# EasyEDA Pro project Module32Switches_SM.epro

# Schematic Main
Board Name: 32 switches module; Create Date: 2025-06-25; Page Name: P1; Project Name: Module32Switches_SM; Schematic Name: Main; Update Date: 2025-06-27; Company: EasyEDA.com; Page Size: A4; Version: V1.0
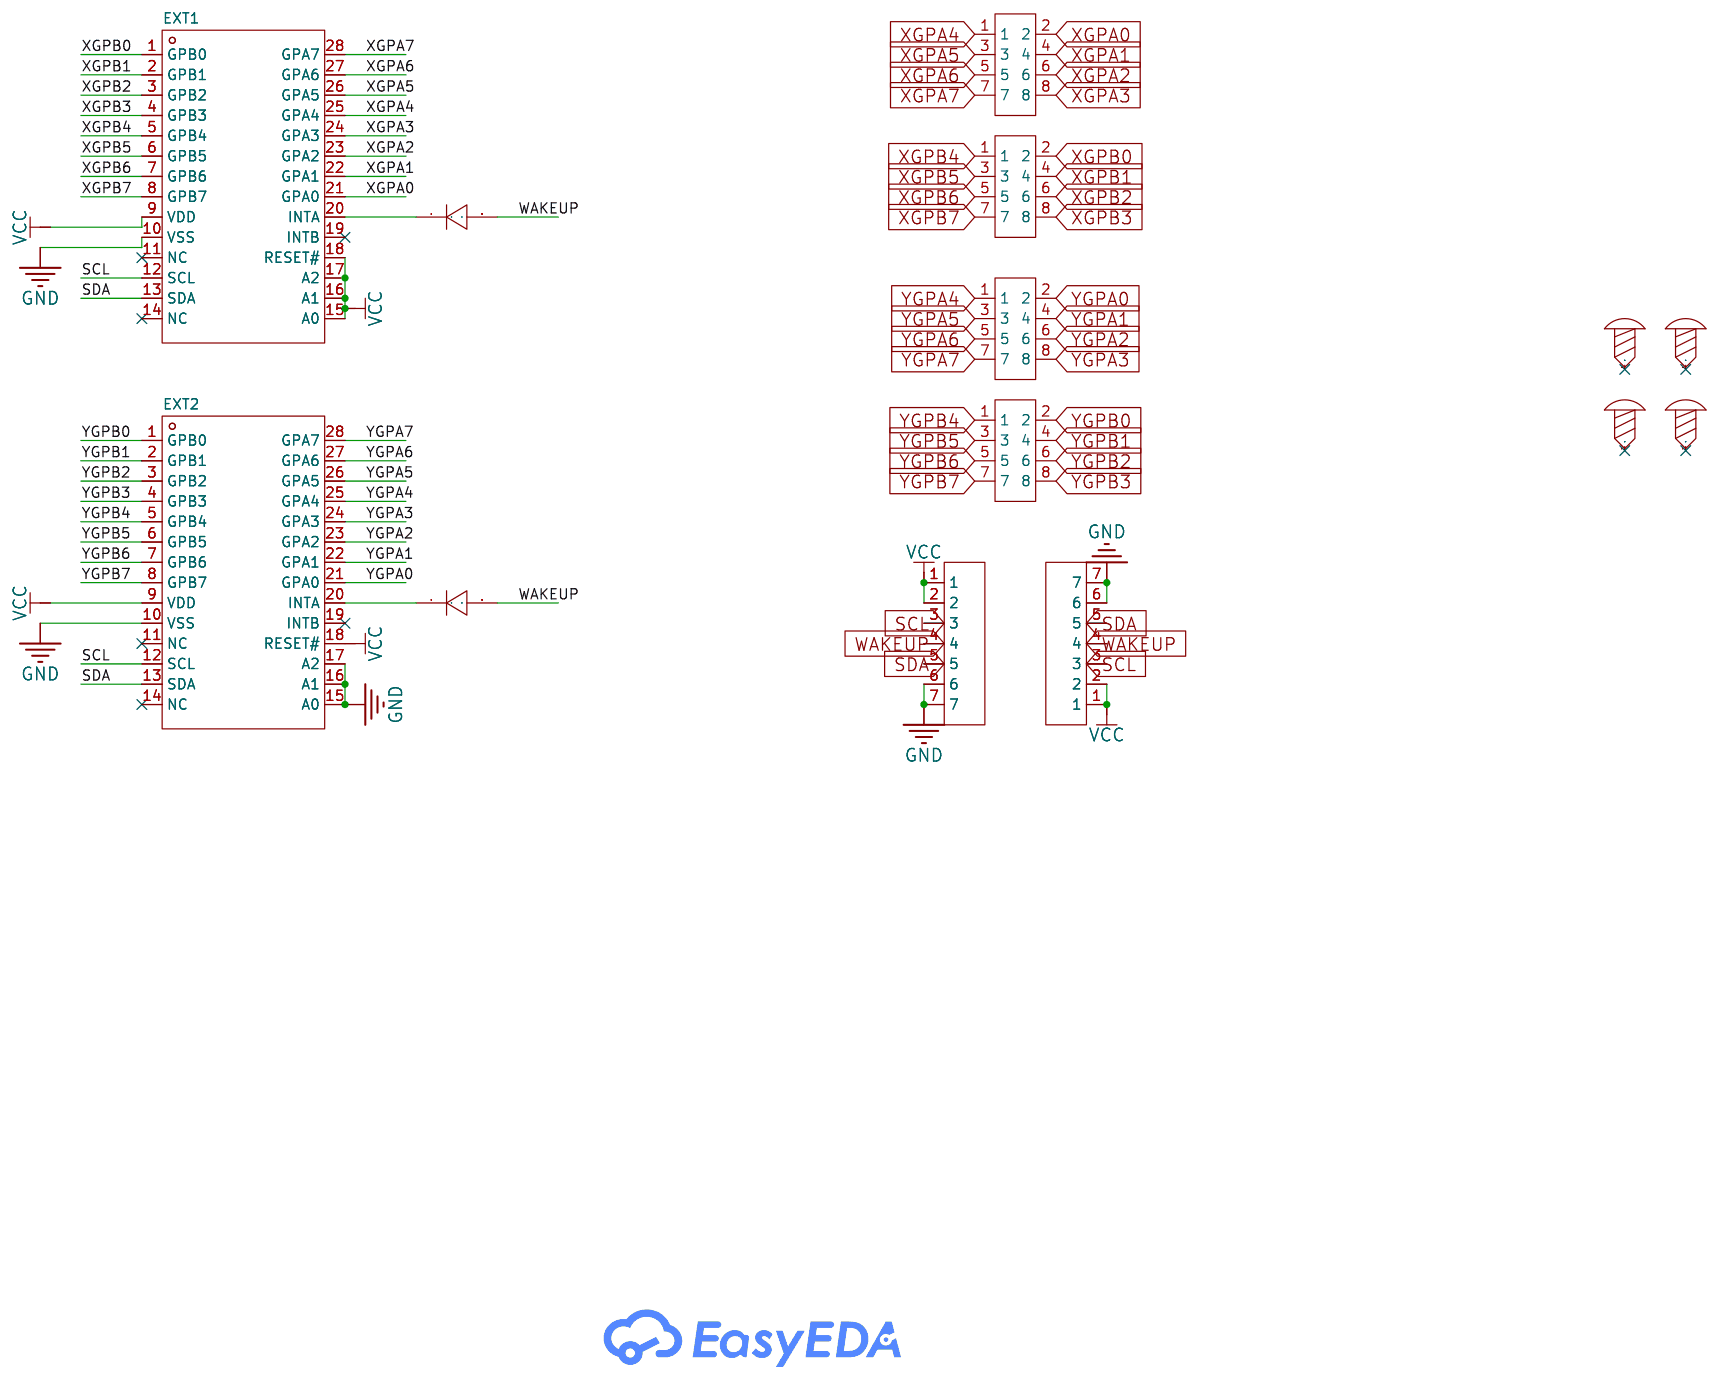
[diagram p0: schematic sheet]

## Parts
D1  1N4148W  [SOD-123F_L2.7-W1.6-LS3.8-RD]
D2  1N4148W  [SOD-123F_L2.7-W1.6-LS3.8-RD]
DEVKIT1  -  [HDR-TH_7P-P2.54-V-M]  (no BOM)
DEVKIT2  -  [HDR-TH_7P-P2.54-V-M]  (no BOM)
EXT1  MCP23017T-E/ML  [QFN-28_L6.0-W6.0-P0.65-BL-EP3.7]
EXT2  MCP23017T-E/ML  [QFN-28_L6.0-W6.0-P0.65-BL-EP3.7]
SCREW1  -  [Screw-Hole-M2]  (no BOM)
SCREW2  -  [Screw-Hole-M2]  (no BOM)
SCREW3  -  [Screw-Hole-M2]  (no BOM)
SCREW4  -  [Screw-Hole-M2]  (no BOM)
XH1  PZ254R-12-8P  [HDR-TH_8P-P2.54-H-M-R2-C4-S2.54]  (no BOM)
XH2  PZ254R-12-8P  [HDR-TH_8P-P2.54-H-M-R2-C4-S2.54]  (no BOM)
YH1  PZ254R-12-8P  [HDR-TH_8P-P2.54-H-M-R2-C4-S2.54]  (no BOM)
YH2  PZ254R-12-8P  [HDR-TH_8P-P2.54-H-M-R2-C4-S2.54]  (no BOM)

## Library data of the parts
D1 D2 = 1N4148W_C81598: Diode Configuration:Independent Type Forward Voltage (Vf@If):1V@50mA Reverse Voltage (Vr): Rectified Current: Reverse Leakage Current (Ir):1uA@75V Reverse Recovery Time (trr): Operating Temperature:- Operating Temperature:-; Supplier Part: C81598; Manufacturer: ST(先科); Supplier Footprint: SOD-123; JLCPCB Part Class: Basic Part; Datasheet: https://atta.szlcsc.com/upload/public/pdf/source/20161024/1477288446905.pdf; Supplier: LCSC; Diode Configuration: Independent Type; Forward Voltage (Vf@If): 1V@50mA; Reverse Leakage Current (Ir): 1uA@75V
DEVKIT1 DEVKIT2 = HDR-M_2.54_1x7P: Supplier Footprint: Through
EXT1 EXT2 = MCP23017T-E/ML: Interface:- Number of I/O:16 Interrupt Output:With Interrupt Output Output Type:- Voltage - Supply:1.8V~5.5V Voltage - Supply:1.8V~5.5V Current - Output Low(IOL):- Current - Output High(IOH):- Clock Frequency:- Operating Temperature:-40℃~+125℃ Operating T; LCSC Part Name: 16位带串行接口的I/O扩展器; Supplier Part: C629439; Manufacturer: MICROCHIP(美国微芯); Supplier Footprint: QFN-28-EP(6x6); JLCPCB Part Class: Extended Part; Datasheet: https://atta.szlcsc.com/upload/public/pdf/source/20221209/1BF939F88C2D907BC056D7BF485E3103.pdf; Supplier: LCSC; Number of I/O: 16; Interrupt Output: With Interrupt Output; Voltage - Supply: 1.8V~5.5V; Operating Temperature: -40℃~+125℃
SCREW1-SCREW4 = Screw-Hole-M2: Supplier Footprint: 插件
XH1 XH2 YH1 YH2 = PZ254R-12-8P: Pin Structure:2x4P Pitch:2.54mm Row Spacing:2.54mm Circluar Pins/Square Pins:Policy Mounting Type:Right-Angle Number of Rows:Double Row Number of Pins:8P Current Rating:- Voltage Rating (Max):- Length of Mating Pin:6mm Insulation Height:2.5mm Contact Mate; LCSC Part Name: 2x4P 间距:2.54mm 方针 弯插; Supplier Part: C492432; Manufacturer: XFCN(兴飞); Supplier Footprint: 弯插,P=2.54mm; JLCPCB Part Class: Extended Part; Datasheet: https://atta.szlcsc.com/upload/public/pdf/source/20200309/C492432_F55471C7391A7FE3415CB31C718B6320.pdf; Supplier: LCSC; Pin Structure: 2x4P; Pitch: 2.54mm; Row Spacing: 2.54mm; Circluar Pins/Square Pins: Policy; Mounting Type: Right-Angle; Number of Rows: Double Row; Number of Pins: 8P; Length of Mating Pin: 6mm; Insulation Height: 2.5mm; Contact Material: Brass; Operating Temperature: -40℃~+105℃; Color: Black

## Nets
GND: DEVKIT1.6 DEVKIT1.7 DEVKIT2.6 DEVKIT2.7 EXT1.10(VSS) EXT2.10(VSS) EXT2.15(A0) EXT2.16(A1) EXT2.17(A2)
VCC: DEVKIT1.1 DEVKIT1.2 DEVKIT2.1 DEVKIT2.2 EXT1.9(VDD) EXT1.15(A0) EXT1.16(A1) EXT1.17(A2) EXT1.18(RESET#) EXT2.9(VDD) EXT2.18(RESET#)
SCL: DEVKIT1.3 DEVKIT2.3 EXT1.12(SCL) EXT2.12(SCL)
SDA: DEVKIT1.5 DEVKIT2.5 EXT1.13(SDA) EXT2.13(SDA)
WAKEUP: D1.2(A) D2.2(A) DEVKIT1.4 DEVKIT2.4
XGPA0: EXT1.21(GPA0) XH1.2
XGPA1: EXT1.22(GPA1) XH1.4
XGPA2: EXT1.23(GPA2) XH1.6
XGPA3: EXT1.24(GPA3) XH1.8
XGPA4: EXT1.25(GPA4) XH1.1
XGPA5: EXT1.26(GPA5) XH1.3
XGPA6: EXT1.27(GPA6) XH1.5
XGPA7: EXT1.28(GPA7) XH1.7
XGPB0: EXT1.1(GPB0) XH2.2
XGPB1: EXT1.2(GPB1) XH2.4
XGPB2: EXT1.3(GPB2) XH2.6
XGPB3: EXT1.4(GPB3) XH2.8
XGPB4: EXT1.5(GPB4) XH2.1
XGPB5: EXT1.6(GPB5) XH2.3
XGPB6: EXT1.7(GPB6) XH2.5
XGPB7: EXT1.8(GPB7) XH2.7
YGPA0: EXT2.21(GPA0) YH1.2
YGPA1: EXT2.22(GPA1) YH1.4
YGPA2: EXT2.23(GPA2) YH1.6
YGPA3: EXT2.24(GPA3) YH1.8
YGPA4: EXT2.25(GPA4) YH1.1
YGPA5: EXT2.26(GPA5) YH1.3
YGPA6: EXT2.27(GPA6) YH1.5
YGPA7: EXT2.28(GPA7) YH1.7
YGPB0: EXT2.1(GPB0) YH2.2
YGPB1: EXT2.2(GPB1) YH2.4
YGPB2: EXT2.3(GPB2) YH2.6
YGPB3: EXT2.4(GPB3) YH2.8
YGPB4: EXT2.5(GPB4) YH2.1
YGPB5: EXT2.6(GPB5) YH2.3
YGPB6: EXT2.7(GPB6) YH2.5
YGPB7: EXT2.8(GPB7) YH2.7
$1N593: D1.1(K) EXT1.20(INTA)
$1N5957: D2.1(K) EXT2.20(INTA)

Not connected (* = marked no-connect by the designer): EXT1 11(NC)* 14(NC)* 19(INTB)*; EXT2 11(NC)* 14(NC)* 19(INTB)*; SCREW1 1*; SCREW2 1*; SCREW3 1*; SCREW4 1*

# Board PCB
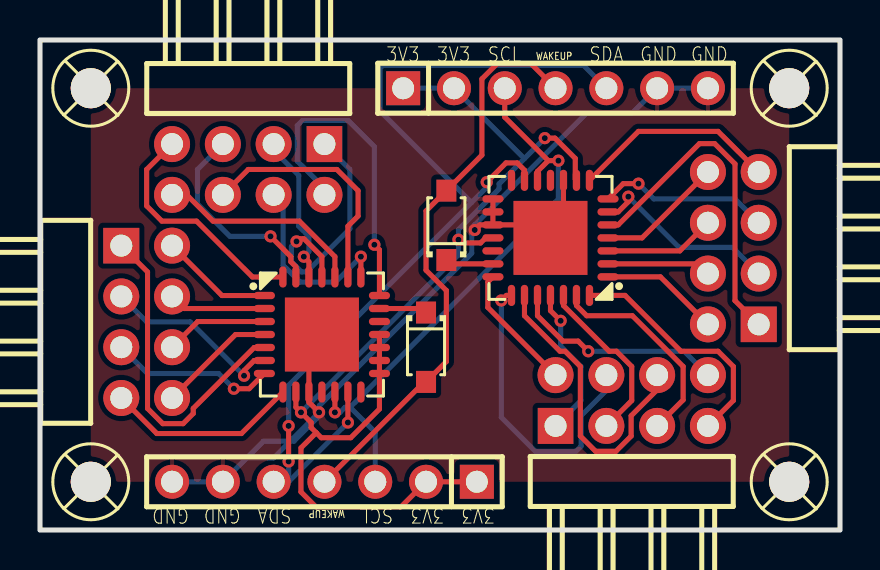
[diagram p1: board, top side]
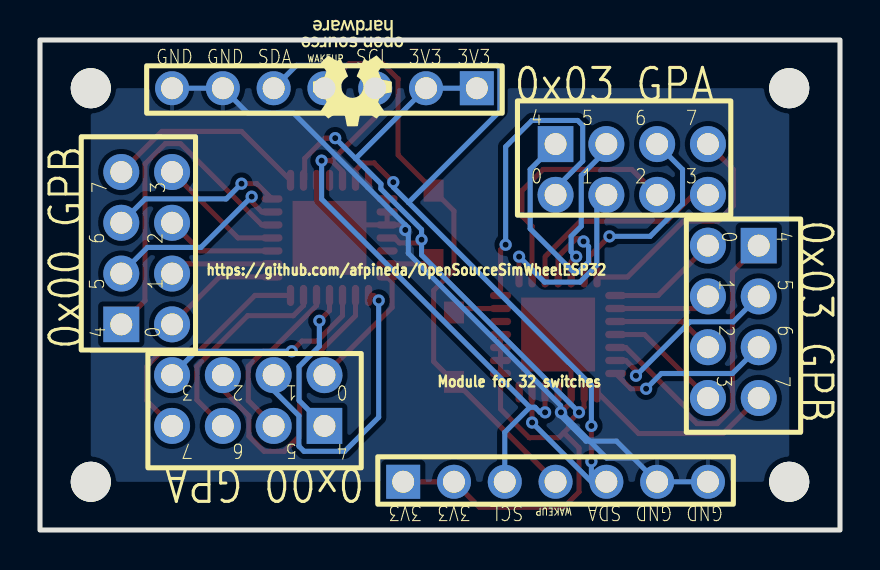
[diagram p2: board, bottom side, seen from below]

Outline 40 x 24.51 mm; copper layers: Top Layer, Bottom Layer. Coordinates in mm from the lower left corner of the outline.
Outline path: rectangle 0,24.51 40,0
Stack: Top Layer 0.035mm / Dielectric1 1.51mm FR4 er 4.5 / Bottom Layer 0.035mm

## Design rules (mm)
template: JLCPCB Capability(Two Layers Board)
spacing copperThickness1oz (default): track to track 0.102, other pairs 0.152 to 0.3
spacing copperThickness2oz: track to track 0.203, other pairs 0.152 to 0.3
track width copperThickness1oz (default): min 0.127, default 0.254, max 2.54
track width copperThickness2oz: min 0.203, default 0.254, max 2.54
differential pair differentialPair (default): width min 0.127, default 0.254, max 2.54; gap min 0.152, default 0.152
via viaSize (default): diameter min 0.5, default 0.61, max 10; hole min 0.3, default 0.305, max 6.3

## Placement (name value [footprint] x y rotation side)
D1  1N4148W  [SOD-123F_L2.7-W1.6-LS3.8-RD]  19.3 9.14 270 top
D2  1N4148W  [SOD-123F_L2.7-W1.6-LS3.8-RD]  20.32 15.24 90 top
DEVKIT1  -  [HDR-TH_7P-P2.54-V-M]  14.22 2.41 180 top
DEVKIT2  -  [HDR-TH_7P-P2.54-V-M]  25.78 22.1 0 top
EXT1  MCP23017T-E/ML  [QFN-28_L6.0-W6.0-P0.65-BL-EP3.7]  14.1 9.78 270 top
EXT2  MCP23017T-E/ML  [QFN-28_L6.0-W6.0-P0.65-BL-EP3.7]  25.53 14.61 90 top
SCREW1  -  [Screw-Hole-M2]  37.47 22.1 0 top
SCREW2  -  [Screw-Hole-M2]  37.47 2.41 0 top
SCREW3  -  [Screw-Hole-M2]  2.54 2.41 0 top
SCREW4  -  [Screw-Hole-M2]  2.54 22.1 0 top
XH1  PZ254R-12-8P  [HDR-TH_8P-P2.54-H-M-R2-C4-S2.54]  10.41 18.03 180 top
XH2  PZ254R-12-8P  [HDR-TH_8P-P2.54-H-M-R2-C4-S2.54]  5.33 10.41 270 top
YH1  PZ254R-12-8P  [HDR-TH_8P-P2.54-H-M-R2-C4-S2.54]  29.59 6.48 0 top
YH2  PZ254R-12-8P  [HDR-TH_8P-P2.54-H-M-R2-C4-S2.54]  34.67 14.1 90 top

## Footprints (pads in the part's own frame, mm; a bottom-side part is the same pattern mirrored in y, then rotated)
HDR-TH_7P-P2.54-V-M
  rect 1.7x1.7 hole 1.1: 1(-7.62,0)
  round 1.7 hole 1.1: 2(-5.08,0) 3(-2.54,0) 4(0,0) 5(2.54,0) 6(5.08,0) 7(7.62,0)
HDR-TH_8P-P2.54-H-M-R2-C4-S2.54
  rect 1.778x1.8 hole 1.1: 1(-3.81,-1.27)
  round 1.8 hole 1.1: 2(-3.81,1.27) 3(-1.27,-1.27) 4(-1.27,1.27) 5(1.27,-1.27) 6(1.27,1.27) 7(3.81,-1.27) 8(3.81,1.27)
QFN-28_L6.0-W6.0-P0.65-BL-EP3.7
  oval 0.364x1.055 smd: 1(-1.95,-2.877) 2(-1.3,-2.877) 3(-0.65,-2.877) 4(0,-2.877) 5(0.65,-2.877) 6(1.3,-2.877) 7(1.95,-2.877) 15(1.95,2.877) 16(1.3,2.877) 17(0.65,2.877) 18(0,2.877) 19(-0.65,2.877) 20(-1.3,2.877) 21(-1.95,2.877)
  oval 1.055x0.364 smd: 8(2.877,-1.95) 9(2.877,-1.3) 10(2.877,-0.65) 11(2.877,0) 12(2.877,0.65) 13(2.877,1.3) 14(2.877,1.95) 22(-2.877,1.95) 23(-2.877,1.3) 24(-2.877,0.65) 25(-2.877,0) 26(-2.877,-0.65) 27(-2.877,-1.3) 28(-2.877,-1.95)
  rect 3.7x3.7 smd: 29(0,0)
Screw-Hole-M2
  round 2 hole 2: 1(0,0)
SOD-123F_L2.7-W1.6-LS3.8-RD
  rect 1.1x1 smd: 1(-1.735,0) 2(1.735,0)

## Nets
As in the schematic, except:
GND: DEVKIT1.6 DEVKIT1.7 DEVKIT2.6 DEVKIT2.7 EXT1.10 EXT1.29 EXT2.10 EXT2.15 EXT2.16 EXT2.17 EXT2.29

Pads without a net: EXT1 11 14 19; EXT2 11 14 19; SCREW1 1; SCREW2 1; SCREW3 1; SCREW4 1

## Via types
v1: diameter 0.61, hole 0.305, Top Layer to Bottom Layer, 23 vias

## Routing (per net, layer and track width the routed paths; a pad name or vN(x,y) marks a point on that pad's centre or on a via; arc(x,y) is an arc through that point)
GND: length 53.7
  Top Layer w0.254: 25.38,14.75 EXT2.29 ; 25.38,14.75 26.18,15.55 EXT2.10 ; 25.38,14.75 24.94,14.75 24.43,15.26 EXT2.17 ; EXT2.15 EXT2.16 EXT2.17 ; v1(13.96,5.89) 13.45,6.39 EXT1.10 13.45,9.13 EXT1.29 ; v1(21.74,15.01) 21.99,15.26 EXT2.17
  Bottom Layer w0.254: 21.74,15.26 21.59,15.11 21.59,13.84 13.97,6.22 13.97,5.72 12.7,4.44 12.51,4.44 ; 21.74,15.26 27.33,20.85 29.61,20.85 30.86,22.1 DEVKIT2.7 ; 21.74,15.26 v1(21.74,15.01) ; v1(13.96,5.89) 12.51,4.44 ; 12.51,4.44 11.18,4.44 10.33,3.6 ; 12.51,4.44 11.67,3.6 10.33,3.6 ; DEVKIT1.7 DEVKIT1.6 10.33,3.6
VCC: length 54.2
  Top Layer w0.254: EXT1.9 12.8,6.14 v1(13.05,5.89) 13.56,5.38 13.56,5.12 13.81,4.87 ; EXT2.18 22.29,14.61 22.03,14.36 21.09,14.36 v1(20.93,14.52) ; 13.81,4.87 13.05,4.11 13.05,1.91 13.81,1.14 18.03,1.14 DEVKIT1.2 DEVKIT1.1 ; 13.81,4.87 14.07,4.62 15.54,4.62 16.97,6.05 EXT1.15 EXT1.16 EXT1.17 EXT1.18 ; EXT2.9 26.77,17.55 26.77,18.59 25.75,19.6 v1(25.24,19.6)
  Bottom Layer w0.254: DEVKIT2.1 DEVKIT2.2 24.21,18.59 24.23,18.59 ; 24.23,18.59 22.96,17.32 22.96,17.06 20.93,15.03 v1(20.93,14.52) 20.93,13.76 v1(13.05,5.89) ; 24.23,18.59 v1(25.24,19.6)
SCL: length 29
  Top Layer w0.254: 25.41,18.48 24.88,17.94 EXT2.12 ; 25.41,18.48 23.24,20.65 DEVKIT2.3 ; 25.41,18.48 v1(25.92,18.48) ; EXT1.12 v1(14.75,5.89)
  Bottom Layer w0.254: DEVKIT1.3 16.76,4.88 15.51,6.14 ; 15.51,6.14 25.92,16.55 v1(25.92,18.48) ; 15.51,6.14 15.25,6.14 15,5.89 v1(14.75,5.89)
SDA: length 49
  Top Layer w0.254: 24.23,17.49 24.23,18 23.86,18.36 23.3,18.36 v1(22.34,17.4) ; 15.4,6.9 v1(15.4,5.38) ; v1(12.43,3.43) v1(12.43,5.21)
  Bottom Layer w0.254: DEVKIT2.5 27.18,23.24 17.15,23.24 17,23.09 17,20.95 21.58,16.38 ; v1(15.4,5.38) 12.43,2.41 ; 12.43,2.41 DEVKIT1.5 ; 12.43,2.41 v1(12.43,3.43) ; v1(22.34,17.4) 22.34,17.14 21.58,16.38 ; 21.58,16.38 12.43,7.24 v1(12.43,5.21)
WAKEUP: length 28.8
  Top Layer w0.254: DEVKIT2.4 24.55,23.33 22.86,23.33 22.1,22.56 22.1,18.75 D2.2 19.3,15.96 19.3,13 20.32,11.98 20.32,8.42 D1.2 19.22,7.41 DEVKIT1.4
XGPA0: length 16.1
  Top Layer w0.254: EXT1.21 16.97,14.02 v1(16.72,14.27)
  Bottom Layer w0.254: v1(16.72,14.27) 16.72,19.17 15.41,20.49 13.12,20.49 12.87,20.23 12.87,18.45 14.14,17.18 14.14,16.85 XH1.2
XGPA1: length 9.5
  Top Layer w0.254: EXT1.22 v1(16.05,13.67)
  Bottom Layer w0.254: v1(16.05,13.67) 14.78,12.4 13,12.4 12.16,13.24 12.16,16.29 XH1.4
XGPA2: length 12.3
  Top Layer w0.254: 15.4,12.66 15.4,15.2 15.91,15.7 15.91,16.97 14.85,18.03 10.41,18.03 XH1.6
XGPA3: length 10.4
  Top Layer w0.254: XH1.8 6.65,16.72 7.38,16.72 8.65,15.45 12.97,15.45 14.75,13.67 EXT1.24
XGPA4: length 12.6
  Top Layer w0.254: v1(12.83,14.43) 12.96,14.57 13.2,14.57 14.1,13.67 EXT1.25
  Bottom Layer w0.254: v1(12.83,14.43) 12.57,14.18 12.57,13.42 13.08,12.91 13.34,12.91 15.49,15.07 15.49,18.03 XH1.1
XGPA5: length 7.6
  Top Layer w0.254: EXT1.26 13.45,13.42 v1(13.19,13.67)
  Bottom Layer w0.254: v1(13.19,13.67) 13.45,13.93 13.45,14.69 12.94,15.2 12.94,17.74 11.68,18.99 XH1.3
XGPA6: length 10.4
  Top Layer w0.254: v1(11.53,14.69) 12.54,13.67 12.54,13.42 12.8,13.16 EXT1.27
  Bottom Layer w0.254: XH1.5 7.87,18.03 7.87,16.31 9.5,14.69 v1(11.53,14.69)
XGPA7: length 11.9
  Top Layer w0.254: EXT1.28 10.62,12.66 7.83,15.45 6.1,15.45 5.33,16.21 5.33,18.03 XH1.7
XGPB0: length 5.6
  Top Layer w0.254: XH2.2 9.1,11.73 EXT1.1
XGPB1: length 4.9
  Top Layer w0.254: XH2.4 7.21,11.08 EXT1.2
XGPB2: length 5.1
  Top Layer w0.254: EXT1.3 7.89,10.43 XH2.6
XGPB3: length 5.9
  Top Layer w0.254: EXT1.4 9.78,9.78 XH2.8
XGPB4: length 16.6
  Top Layer w0.254: XH2.1 5.38,12.91 5.38,6.08 6.14,5.32 7.16,5.32 7.66,5.83 7.66,6.08 10.71,9.13 EXT1.5
XGPB5: length 9.3
  Top Layer w0.254: EXT1.6 10.71,8.48 10.2,7.97 v1(10.2,7.72)
  Bottom Layer w0.254: XH2.3 5.33,10.41 7.51,10.41 v1(10.2,7.72)
XGPB6: length 8.3
  Top Layer w0.254: EXT1.7 10.46,7.07 v1(9.7,7.07)
  Bottom Layer w0.254: v1(9.7,7.07) 8.93,7.83 5.38,7.83 XH2.5
XGPB7: length 9.7
  Top Layer w0.254: EXT1.8 10.07,4.83 5.84,4.83 XH2.7
YGPA0: length 6.4
  Top Layer w0.254: EXT2.21 22.4,12.41 22.4,11.13 YH1.2
YGPA1: length 15.3
  Top Layer w0.254: v1(23.07,11.48) 23.32,11.73 EXT2.22
  Bottom Layer w0.254: v1(23.07,11.48) 23.07,5.64 24.77,3.94 26.8,3.94 27.06,4.19 27.06,5.72 28.33,6.98 YH1.4
YGPA2: length 15.1
  Top Layer w0.254: 24.23,11.73 24.23,10.72 26,8.94 26.26,8.94 27.02,8.18 27.02,4.7 27.78,3.94 28.8,3.94 29.56,4.7 29.56,5.72 30.83,6.98 30.83,7.72 30.86,7.75
YGPA3: length 10.8
  Top Layer w0.254: EXT2.24 24.88,10.72 26.15,9.45 26.91,9.45 v1(27.42,8.94)
  Bottom Layer w0.254: v1(27.42,8.94) 32.21,8.94 YH1.8
YGPA4: length 7.7
  Top Layer w0.254: v1(26.03,10.47) 25.53,10.97 EXT2.25
  Bottom Layer w0.254: v1(26.03,10.47) 26.03,9.19 27.05,8.18 27.05,6.48 YH1.1
YGPA5: length 8.7
  Top Layer w0.254: EXT2.26 26.18,11.23 28.46,8.94 28.83,8.94 29.59,8.18 29.59,6.48 YH1.3
YGPA6: length 10.6
  Top Layer w0.254: 30.86,5.21 32.16,6.51 32.16,8.18 29.62,10.72 27.34,10.72 26.83,11.23 EXT2.27
YGPA7: length 12.2
  Top Layer w0.254: EXT2.28 29.25,11.73 32.05,8.94 33.91,8.94 34.67,8.18 34.67,6.48 YH1.7
YGPB0: length 6
  Top Layer w0.254: YH2.2 31.03,12.66 EXT2.1
YGPB1: length 5.2
  Top Layer w0.254: YH2.4 32.92,13.31 EXT2.2
YGPB2: length 5.6
  Top Layer w0.254: EXT2.3 32,13.96 YH2.6
YGPB3: length 6.4
  Top Layer w0.254: EXT2.4 30.11,14.61 YH2.8
YGPB4: length 17
  Top Layer w0.254: YH2.1 34.75,11.47 34.75,18.31 33.74,19.33 32.98,19.33 28.91,15.26 EXT2.5
YGPB5: length 9.6
  Top Layer w0.254: v1(29.42,16.67) 29.42,16.42 28.91,15.91 EXT2.6
  Bottom Layer w0.254: v1(29.42,16.67) 31.96,14.13 34.63,14.13 YH2.3
YGPB6: length 8.7
  Top Layer w0.254: v1(29.93,17.32) 29.17,17.32 EXT2.7
  Bottom Layer w0.254: v1(29.93,17.32) 30.69,16.56 34.75,16.56 YH2.5
YGPB7: length 10.3
  Top Layer w0.254: EXT2.8 29.93,19.94 33.91,19.94 YH2.7
$1N593: length 2.4
  Top Layer w0.254: D1.1 19.1,11.08 EXT1.20
$1N5957: length 2.4
  Top Layer w0.254: EXT2.20 20.51,13.31 D2.1

## Copper pours and planes (outline as drawn; the poured copper is in the pictures)
GND on Top Layer: 2.54,22.1 37.47,22.1 37.47,2.41 2.54,2.41
GND on Bottom Layer: 2.54,22.1 37.47,22.1 37.47,2.41 2.54,2.41

## Text on the board
Bottom Silkscreen Layer: WAKEUP | Module for 32 switches | https://github.com/afpineda/OpenSourceSimWheelESP32 | 7 | 3 | 6 | 2 | 5 | 1 | 4 | 0 | 3V3 | SCL | SDA | GND | 0x03 GPA | 0x03 GPB | 0x00 GPA | 0x00 GPB
Top Silkscreen Layer: WAKEUP | 3V3 | SCL | SDA | GND
